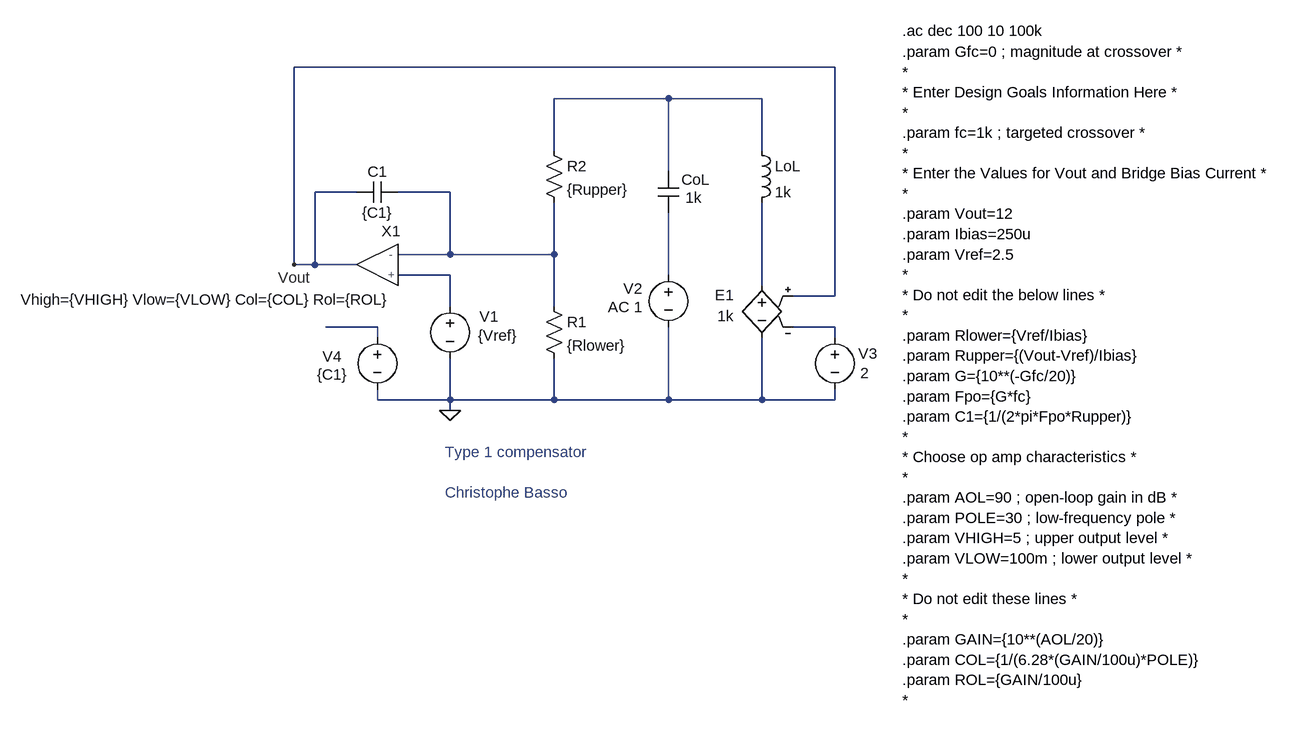
[diagram p0: schematic type 1 - op amp.asc]
type 1 - op amp.asc, the LTspice schematic file:
Version 4
SHEET 1 1564 768
WIRE 832 -128 0 -128
WIRE 576 -80 400 -80
WIRE 720 -80 576 -80
WIRE 400 0 400 -80
WIRE 720 0 720 -80
WIRE 576 32 576 -80
WIRE 96 64 32 64
WIRE 240 64 160 64
WIRE 240 160 240 64
WIRE 240 160 160 160
WIRE 400 160 400 80
WIRE 400 160 240 160
WIRE 0 176 0 -128
WIRE 32 176 32 64
WIRE 32 176 0 176
WIRE 96 176 32 176
WIRE 240 192 160 192
WIRE 576 192 576 96
WIRE 720 208 720 80
WIRE 832 224 832 -128
WIRE 832 224 768 224
WIRE 240 240 240 192
WIRE 400 240 400 160
WIRE 128 272 48 272
WIRE 832 272 768 272
WIRE 128 288 128 272
WIRE 832 288 832 272
WIRE 128 384 128 368
WIRE 240 384 240 320
WIRE 240 384 128 384
WIRE 400 384 400 320
WIRE 400 384 240 384
WIRE 576 384 576 272
WIRE 576 384 400 384
WIRE 720 384 720 288
WIRE 720 384 576 384
WIRE 832 384 832 368
WIRE 832 384 720 384
WIRE 240 400 240 384
FLAG 240 400 0
FLAG 0 176 Vout
DATAFLAG 640 -80 ""
DATAFLAG 112 -128 ""
DATAFLAG 304 160 ""
DATAFLAG 48 272 ""
SYMBOL opampTOF 96 160 M0
WINDOW 0 -53 -20 Bottom 2
WINDOW 39 230 85 Bottom 2
SYMATTR InstName X1
SYMATTR SpiceLine Vhigh={VHIGH} Vlow={VLOW} Col={COL} Rol={ROL}
SYMBOL res 384 224 R0
SYMATTR InstName R1
SYMATTR Value {Rlower}
SYMBOL res 384 -16 R0
SYMATTR InstName R2
SYMATTR Value {Rupper}
SYMBOL voltage 240 224 R0
WINDOW 0 45 32 Left 2
WINDOW 3 43 61 Left 2
WINDOW 123 0 0 Left 0
WINDOW 39 0 0 Left 0
SYMATTR InstName V1
SYMATTR Value {Vref}
SYMBOL cap 160 48 R90
WINDOW 0 0 32 VBottom 2
WINDOW 3 32 32 VTop 2
SYMATTR InstName C1
SYMATTR Value {C1}
SYMBOL cap 560 32 R0
WINDOW 0 36 13 Left 2
WINDOW 3 42 41 Left 2
SYMATTR InstName CoL
SYMATTR Value 1k
SYMBOL voltage 576 176 M0
WINDOW 0 40 37 Left 2
WINDOW 123 40 65 Left 2
WINDOW 39 0 0 Left 0
SYMATTR InstName V2
SYMATTR Value2 AC 1
SYMATTR Value ""
SYMBOL ind 704 -16 R0
SYMATTR InstName LoL
SYMATTR Value 1k
SYMBOL e 720 192 M0
WINDOW 0 43 31 Left 2
WINDOW 3 43 63 Left 2
SYMATTR InstName E1
SYMATTR Value 1k
SYMBOL voltage 832 272 R0
WINDOW 0 36 41 Left 2
WINDOW 3 39 71 Left 2
SYMATTR InstName V3
SYMATTR Value 2
SYMBOL voltage 128 272 R0
WINDOW 0 -84 45 Left 2
WINDOW 3 -93 73 Left 2
WINDOW 123 0 0 Left 0
WINDOW 39 0 0 Left 0
SYMATTR InstName V4
SYMATTR Value {C1}
TEXT 936 -152 Left 2 !.param Gfc=0 ; magnitude at crossover *\n*\n* Enter Design Goals Information Here *\n*\n.param fc=1k ; targeted crossover *\n*\n* Enter the Values for Vout and Bridge Bias Current *\n*\n.param Vout=12\n.param Ibias=250u\n.param Vref=2.5\n*\n* Do not edit the below lines *\n*\n.param Rlower={Vref/Ibias}\n.param Rupper={(Vout-Vref)/Ibias}\n.param G={10**(-Gfc/20)}\n.param Fpo={G*fc}\n.param C1={1/(2*pi*Fpo*Rupper)}\n*\n* Choose op amp characteristics *\n*\n.param AOL=90 ; open-loop gain in dB *\n.param POLE=30 ; low-frequency pole *\n.param VHIGH=5 ; upper output level *\n.param VLOW=100m ; lower output level *\n*\n* Do not edit these lines *\n*\n.param GAIN={10**(AOL/20)}\n.param COL={1/(6.28*(GAIN/100u)*POLE)}\n.param ROL={GAIN/100u}\n*
TEXT 936 -184 Left 2 !.ac dec 100 10 100k
TEXT 232 464 Left 2 ;Type 1 compensator\n \nChristophe Basso

The netlist it stands for:
* type 1 - op amp.asc
XX1 N002 N003 Vout opampTOF params: Vhigh={VHIGH} Vlow={VLOW} Col={COL} Rol={ROL}  ; pins - + OUT
R1 N002 0 {Rlower}
R2 N001 N002 {Rupper}
V1 N003 0 {Vref}
C1 N002 Vout {C1}
CoL N001 N004 1k
V2 N004 0 AC 1
LoL N001 N005 1k
E1 N005 0 Vout N007 1k
V3 N007 0 2
V4 N006 0 {C1}
.param Gfc=0 ; magnitude at crossover *
*
* Enter Design Goals Information Here *
*
.param fc=1k ; targeted crossover *
*
* Enter the Values for Vout and Bridge Bias Current *
*
.param Vout=12
.param Ibias=250u
.param Vref=2.5
*
* Do not edit the below lines *
*
.param Rlower={Vref/Ibias}
.param Rupper={(Vout-Vref)/Ibias}
.param G={10**(-Gfc/20)}
.param Fpo={G*fc}
.param C1={1/(2*pi*Fpo*Rupper)}
*
* Choose op amp characteristics *
*
.param AOL=90 ; open-loop gain in dB *
.param POLE=30 ; low-frequency pole *
.param VHIGH=5 ; upper output level *
.param VLOW=100m ; lower output level *
*
* Do not edit these lines *
*
.param GAIN={10**(AOL/20)}
.param COL={1/(6.28*(GAIN/100u)*POLE)}
.param ROL={GAIN/100u}
*
.ac dec 100 10 100k
* Type 1 compensator
* Christophe Basso
.backanno
.end